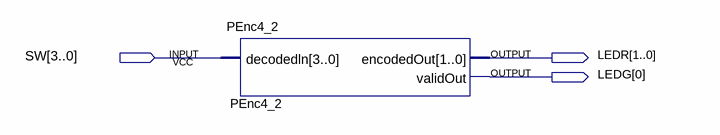
[diagram p0: schematic sheet]
// Quartus schematic PEnc4_2Demo.bdf as structural Verilog: 1 symbols, 3 pins
module PEnc4_2Demo (
  input  [3:0] SW,
  output [1:0] LEDR,
  output [0:0] LEDG
);

  PEnc4_2 PEnc4_2 (.decodedln(SW), .encodedOut(LEDR), .validOut(LEDG[0]));
endmodule
